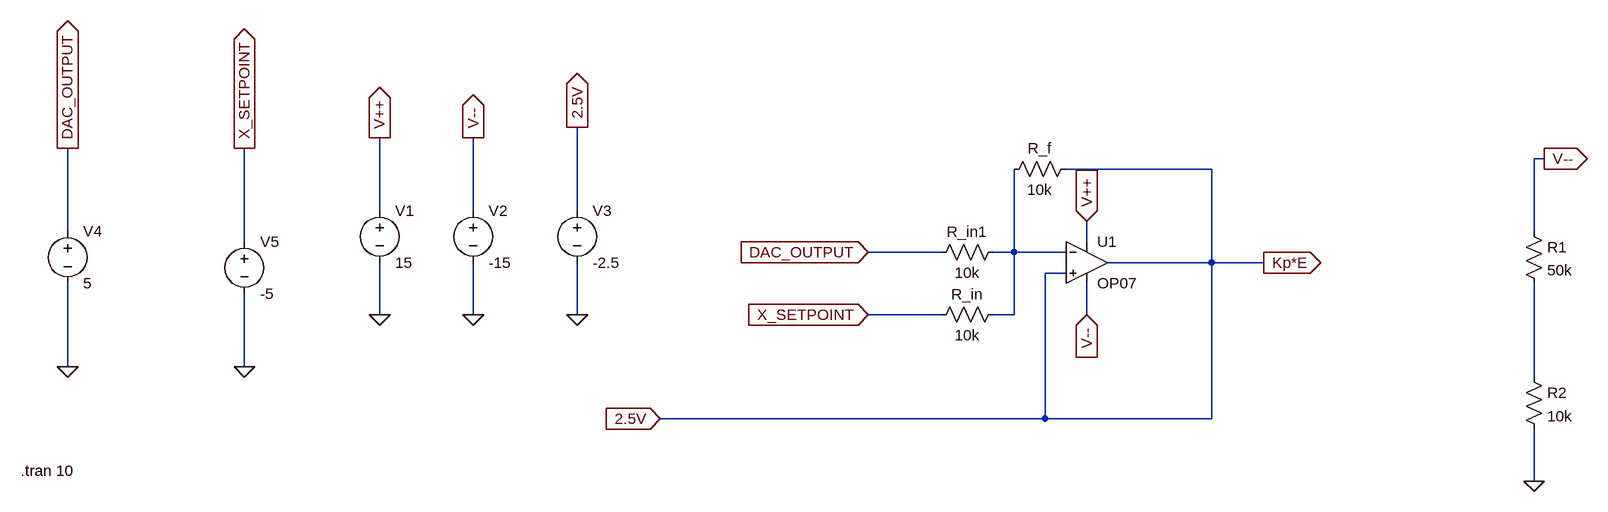
[diagram p0: schematic ControllerCircuit2.asc]
ControllerCircuit2.asc, the LTspice schematic file:
Version 4
SHEET 1 1992 680
WIRE 1536 -16 1520 -16
WIRE 1024 0 800 0
WIRE -256 64 -256 -48
WIRE -112 64 -112 -48
WIRE 48 64 48 -64
WIRE -736 96 -736 -32
WIRE 1520 96 1520 -16
WIRE -464 112 -464 -32
WIRE 832 112 832 80
WIRE 608 128 496 128
WIRE 720 128 720 0
WIRE 720 128 688 128
WIRE 800 128 720 128
WIRE 1024 144 1024 0
WIRE 1024 144 864 144
WIRE 1104 144 1024 144
WIRE 800 160 768 160
WIRE -256 224 -256 144
WIRE -112 224 -112 144
WIRE 48 224 48 144
WIRE 608 224 496 224
WIRE 720 224 720 128
WIRE 720 224 688 224
WIRE 832 224 832 176
WIRE -736 304 -736 176
WIRE -464 304 -464 192
WIRE 1520 320 1520 176
WIRE 768 384 768 160
WIRE 768 384 176 384
WIRE 1024 384 1024 144
WIRE 1024 384 768 384
WIRE 1520 480 1520 400
FLAG -256 -48 V++
IOPIN -256 -48 Out
FLAG -112 -48 V--
IOPIN -112 -48 Out
FLAG 832 80 V++
IOPIN 832 80 In
FLAG 832 224 V--
IOPIN 832 224 In
FLAG -112 224 0
FLAG -256 224 0
FLAG 1104 144 Kp*E
IOPIN 1104 144 Out
FLAG 496 224 X_SETPOINT
IOPIN 496 224 In
FLAG 496 128 DAC_OUTPUT
IOPIN 496 128 In
FLAG 48 224 0
FLAG 48 -64 2.5V
IOPIN 48 -64 Out
FLAG -464 -32 X_SETPOINT
IOPIN -464 -32 Out
FLAG -736 -32 DAC_OUTPUT
IOPIN -736 -32 Out
FLAG -464 304 0
FLAG -736 304 0
FLAG 176 384 2.5V
IOPIN 176 384 In
FLAG 1536 -16 V--
IOPIN 1536 -16 Out
FLAG 1520 480 0
SYMBOL OpAmps\\OP07 832 80 R0
SYMATTR InstName U1
SYMBOL voltage -256 48 R0
WINDOW 123 0 0 Left 0
WINDOW 39 0 0 Left 0
SYMATTR InstName V1
SYMATTR Value 15
SYMBOL voltage -112 48 R0
WINDOW 123 0 0 Left 0
WINDOW 39 0 0 Left 0
SYMATTR InstName V2
SYMATTR Value -15
SYMBOL res 704 112 R90
WINDOW 0 0 56 VBottom 2
WINDOW 3 32 56 VTop 2
SYMATTR InstName R_in1
SYMATTR Value 10k
SYMATTR SpiceLine tol=10
SYMBOL res 704 208 R90
WINDOW 0 0 56 VBottom 2
WINDOW 3 32 56 VTop 2
SYMATTR InstName R_in
SYMATTR Value 10k
SYMATTR SpiceLine tol=10
SYMBOL res 816 -16 R90
WINDOW 0 0 56 VBottom 2
WINDOW 3 32 56 VTop 2
SYMATTR InstName R_f
SYMATTR Value 10k
SYMATTR SpiceLine tol=10
SYMBOL voltage 48 48 R0
WINDOW 123 0 0 Left 0
WINDOW 39 0 0 Left 0
SYMATTR InstName V3
SYMATTR Value -2.5
SYMBOL voltage -736 80 R0
WINDOW 123 0 0 Left 0
WINDOW 39 0 0 Left 0
SYMATTR InstName V4
SYMATTR Value 5
SYMBOL voltage -464 96 R0
WINDOW 123 0 0 Left 0
WINDOW 39 0 0 Left 0
SYMATTR InstName V5
SYMATTR Value -5
SYMBOL res 1504 80 R0
SYMATTR InstName R1
SYMATTR Value 50k
SYMBOL res 1504 304 R0
SYMATTR InstName R2
SYMATTR Value 10k
TEXT -808 464 Left 2 !.tran 10

The netlist it stands for:
* ControllerCircuit2.asc
XU1 2.5V N001 V++ V-- 2.5V LT1001  ; OP07, pins In+ In- V+ V- OUT
V1 V++ 0 15
V2 V-- 0 -15
R_in1 N001 DAC_OUTPUT 10k tol=10
R_in N001 X_SETPOINT 10k tol=10
R_f 2.5V N001 10k tol=10
V3 2.5V 0 -2.5
V4 DAC_OUTPUT 0 5
V5 X_SETPOINT 0 -5
R1 V-- N002 50k
R2 N002 0 10k
.tran 10
.lib LTC.lib
.backanno
.end